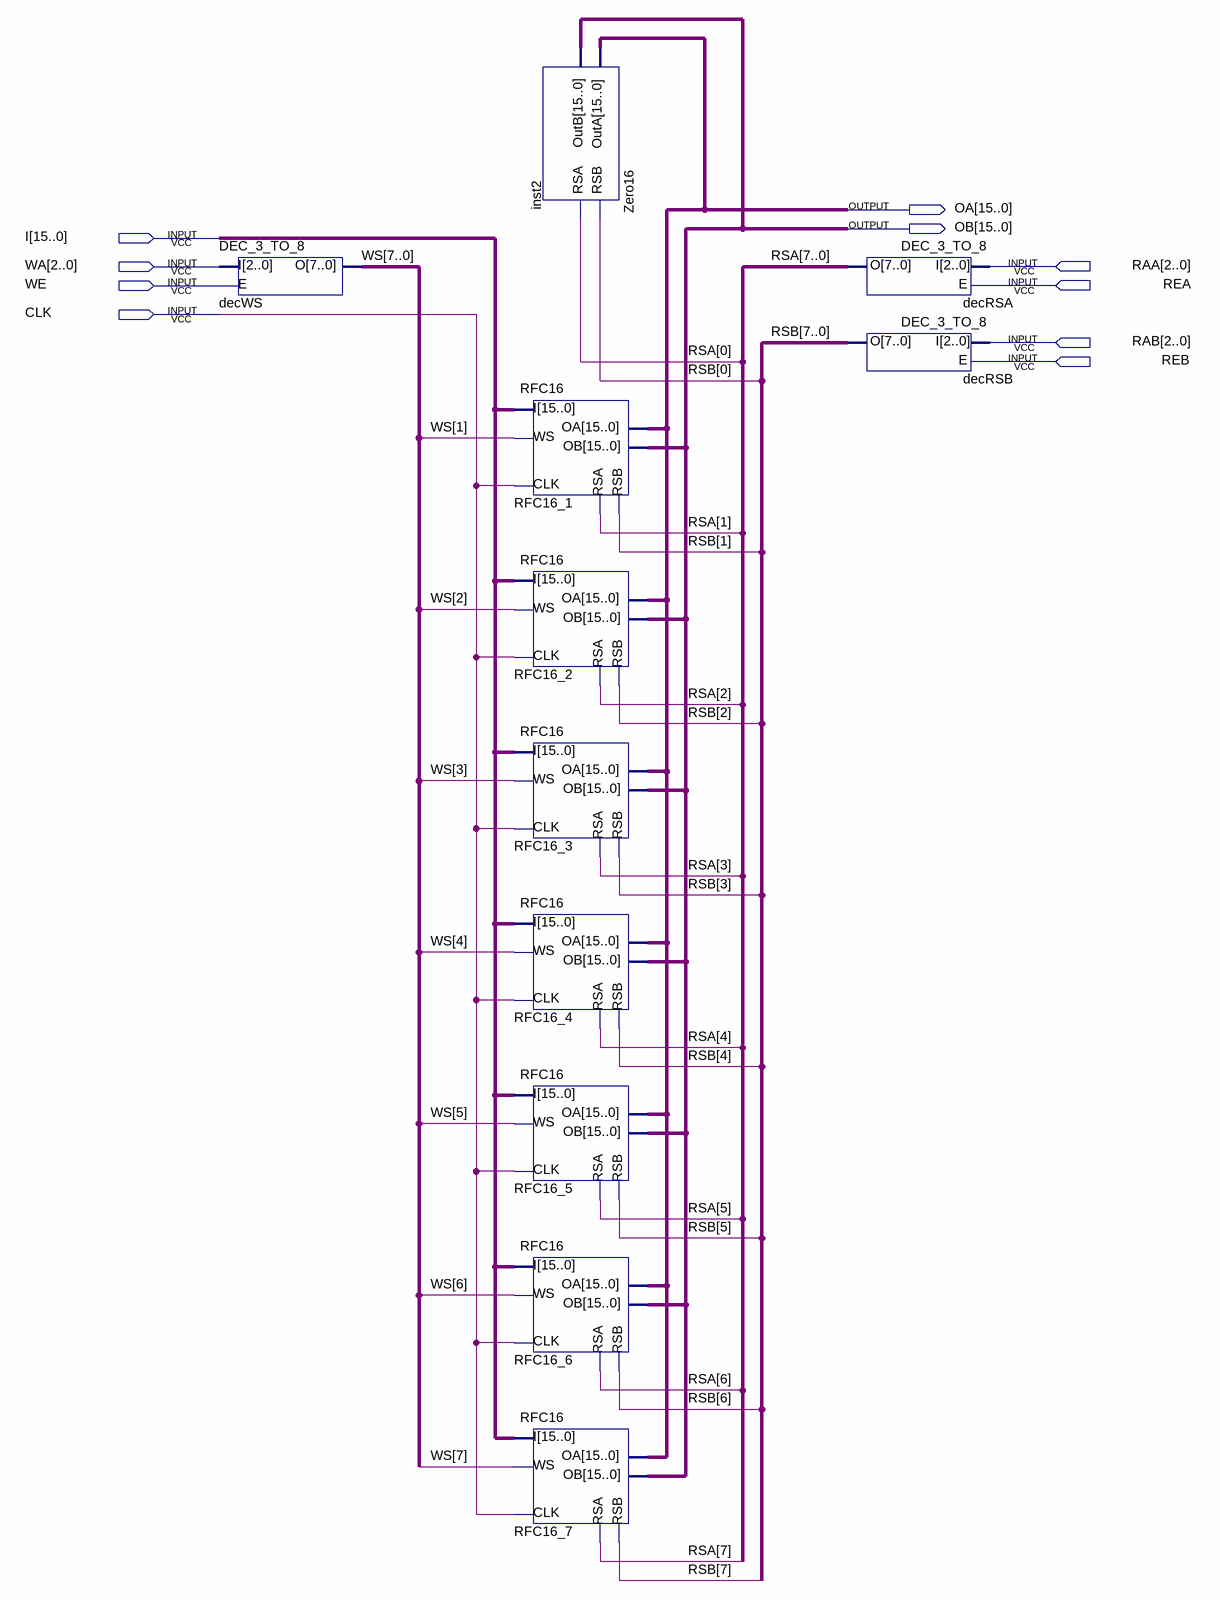
[diagram p0: schematic sheet]
// Quartus schematic RF_8X16.bdf as structural Verilog: 11 symbols, 10 pins
module RF_8X16 (
  input  [15:0] I,
  input  [2:0] WA,
  input  [2:0] RAA,
  input  WE,
  input  REA,
  input  CLK,
  input  [2:0] RAB,
  input  REB,
  output [15:0] OA,
  output [15:0] OB
);

  wire [7:0] RSA, RSB, WS;

  DEC_3_TO_8 decWS (.I(WA), .E(WE), .O(WS));
  Zero16 inst2 (.RSB(RSB[0]), .RSA(RSA[0]), .OutA(OA), .OutB(OB));
  RFC16 RFC16_1 (.I(I), .WS(WS[1]), .CLK(CLK), .RSA(RSA[1]), .RSB(RSB[1]), .OA(OA), .OB(OB));
  RFC16 RFC16_2 (.I(I), .WS(WS[2]), .CLK(CLK), .RSA(RSA[2]), .RSB(RSB[2]), .OA(OA), .OB(OB));
  RFC16 RFC16_3 (.I(I), .WS(WS[3]), .CLK(CLK), .RSA(RSA[3]), .RSB(RSB[3]), .OA(OA), .OB(OB));
  RFC16 RFC16_4 (.I(I), .WS(WS[4]), .CLK(CLK), .RSA(RSA[4]), .RSB(RSB[4]), .OA(OA), .OB(OB));
  RFC16 RFC16_5 (.I(I), .WS(WS[5]), .CLK(CLK), .RSA(RSA[5]), .RSB(RSB[5]), .OA(OA), .OB(OB));
  RFC16 RFC16_6 (.I(I), .WS(WS[6]), .CLK(CLK), .RSA(RSA[6]), .RSB(RSB[6]), .OA(OA), .OB(OB));
  RFC16 RFC16_7 (.I(I), .WS(WS[7]), .CLK(CLK), .RSA(RSA[7]), .RSB(RSB[7]), .OA(OA), .OB(OB));
  DEC_3_TO_8 decRSA (.I(RAA), .E(REA), .O(RSA));
  DEC_3_TO_8 decRSB (.I(RAB), .E(REB), .O(RSB));
endmodule
